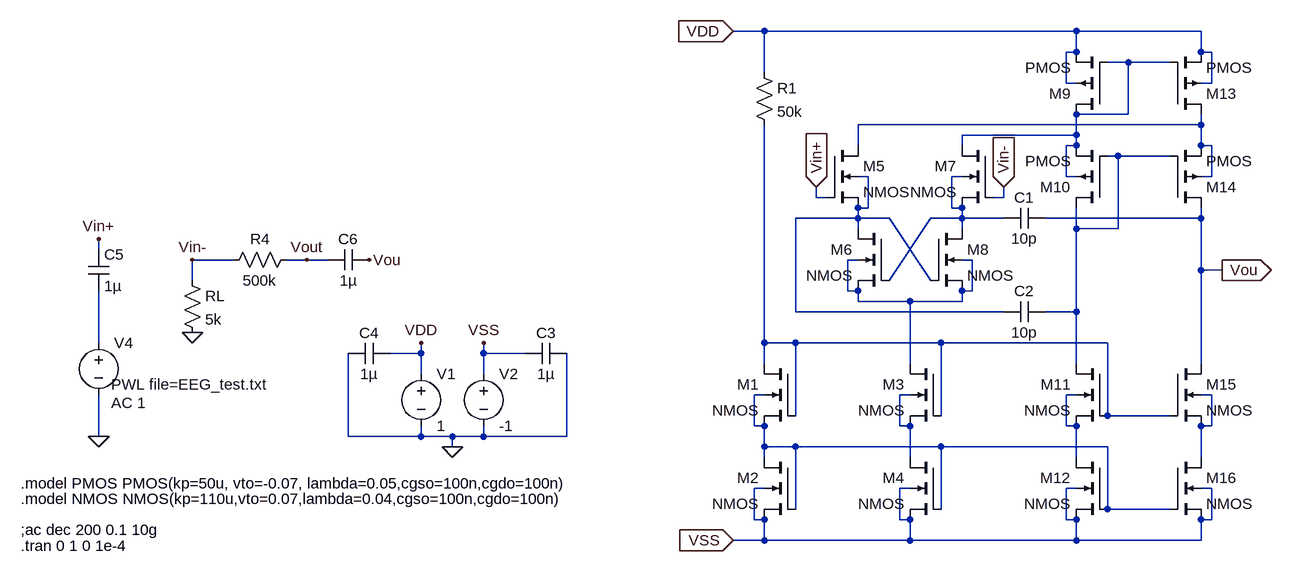
[diagram p0: schematic EEG_Amp1.asc]
EEG_Amp1.asc, the LTspice schematic file:
Version 4
SHEET 1 880 728
WIRE -368 -464 -416 -464
WIRE 112 -464 -368 -464
WIRE 304 -464 112 -464
WIRE 112 -432 112 -464
WIRE 112 -432 96 -432
WIRE 304 -432 304 -464
WIRE 320 -432 304 -432
WIRE 192 -416 160 -416
WIRE 256 -416 192 -416
WIRE -368 -400 -368 -464
WIRE 96 -384 96 -432
WIRE 112 -384 96 -384
WIRE 320 -384 320 -432
WIRE 320 -384 304 -384
WIRE 192 -336 192 -416
WIRE 192 -336 112 -336
WIRE 304 -320 304 -336
WIRE 304 -320 -224 -320
WIRE 112 -304 112 -336
WIRE 112 -304 -64 -304
WIRE -224 -288 -224 -320
WIRE -64 -288 -64 -304
WIRE 112 -288 112 -304
WIRE 112 -288 96 -288
WIRE 304 -288 304 -320
WIRE 320 -288 304 -288
WIRE 176 -272 160 -272
WIRE 256 -272 176 -272
WIRE -208 -240 -224 -240
WIRE -64 -240 -80 -240
WIRE 96 -240 96 -288
WIRE 112 -240 96 -240
WIRE 320 -240 320 -288
WIRE 320 -240 304 -240
WIRE -288 -208 -288 -224
WIRE -272 -208 -288 -208
WIRE 0 -208 0 -224
WIRE 0 -208 -16 -208
WIRE -208 -192 -208 -240
WIRE -208 -192 -224 -192
WIRE -80 -192 -80 -240
WIRE -64 -192 -80 -192
WIRE -224 -176 -224 -192
WIRE -224 -176 -320 -176
WIRE -176 -176 -224 -176
WIRE -64 -176 -64 -192
WIRE -64 -176 -112 -176
WIRE 0 -176 -64 -176
WIRE 304 -176 304 -192
WIRE 304 -176 64 -176
WIRE -224 -160 -224 -176
WIRE -64 -160 -64 -176
WIRE 112 -160 112 -192
WIRE 176 -160 176 -272
WIRE 176 -160 112 -160
WIRE -1392 -128 -1392 -144
WIRE -1184 -112 -1248 -112
WIRE -1072 -112 -1104 -112
WIRE -1040 -112 -1072 -112
WIRE -224 -112 -240 -112
WIRE -48 -112 -64 -112
WIRE 304 -96 304 -176
WIRE 336 -96 304 -96
WIRE -1248 -80 -1248 -112
WIRE -176 -80 -112 -176
WIRE -112 -80 -176 -176
WIRE -240 -64 -240 -112
WIRE -224 -64 -240 -64
WIRE -48 -64 -48 -112
WIRE -48 -64 -64 -64
WIRE -224 -48 -224 -64
WIRE -144 -48 -224 -48
WIRE -64 -48 -64 -64
WIRE -64 -48 -144 -48
WIRE -320 -32 -320 -176
WIRE 0 -32 -320 -32
WIRE 112 -32 112 -160
WIRE 112 -32 64 -32
WIRE -1392 16 -1392 -64
WIRE -368 16 -368 -320
WIRE -320 16 -368 16
WIRE -96 16 -320 16
WIRE 160 16 -96 16
WIRE -896 32 -896 16
WIRE -896 32 -944 32
WIRE -800 32 -800 16
WIRE -736 32 -800 32
WIRE -368 48 -368 16
WIRE -144 48 -144 -48
WIRE 112 48 112 -32
WIRE 304 48 304 -96
WIRE -896 64 -896 32
WIRE -800 64 -800 32
WIRE -368 96 -384 96
WIRE -144 96 -160 96
WIRE 112 96 96 96
WIRE 320 96 304 96
WIRE -320 128 -320 16
WIRE -96 128 -96 16
WIRE 160 128 160 16
WIRE 256 128 160 128
WIRE -384 144 -384 96
WIRE -368 144 -384 144
WIRE -160 144 -160 96
WIRE -144 144 -160 144
WIRE 96 144 96 96
WIRE 112 144 96 144
WIRE 320 144 320 96
WIRE 320 144 304 144
WIRE -1392 160 -1392 96
WIRE -1008 160 -1008 32
WIRE -896 160 -896 144
WIRE -896 160 -1008 160
WIRE -848 160 -896 160
WIRE -800 160 -800 144
WIRE -800 160 -848 160
WIRE -672 160 -672 32
WIRE -672 160 -800 160
WIRE -848 176 -848 160
WIRE -368 176 -368 144
WIRE -320 176 -368 176
WIRE -96 176 -320 176
WIRE 160 176 -96 176
WIRE -368 192 -368 176
WIRE -144 192 -144 144
WIRE 112 192 112 144
WIRE 304 192 304 144
WIRE -368 240 -384 240
WIRE -144 240 -160 240
WIRE 112 240 96 240
WIRE 320 240 304 240
WIRE -320 272 -320 176
WIRE -96 272 -96 176
WIRE 160 272 160 176
WIRE 256 272 160 272
WIRE -384 288 -384 240
WIRE -368 288 -384 288
WIRE -160 288 -160 240
WIRE -144 288 -160 288
WIRE 96 288 96 240
WIRE 112 288 96 288
WIRE 320 288 320 240
WIRE 320 288 304 288
WIRE -368 320 -368 288
WIRE -368 320 -416 320
WIRE -144 320 -144 288
WIRE -144 320 -368 320
WIRE 112 320 112 288
WIRE 112 320 -144 320
WIRE 304 320 304 288
WIRE 304 320 112 320
FLAG 336 -96 Vou
IOPIN 336 -96 Out
FLAG 0 -224 Vin-
IOPIN 0 -224 In
FLAG -288 -224 Vin+
IOPIN -288 -224 In
FLAG -416 -464 VDD
IOPIN -416 -464 In
FLAG -416 320 VSS
IOPIN -416 320 In
FLAG -976 -112 Vou
FLAG -1248 -112 Vin-
FLAG -1392 -144 Vin+
FLAG -896 16 VDD
FLAG -800 16 VSS
FLAG -848 176 0
FLAG -1392 160 0
FLAG -1248 0 0
FLAG -1072 -112 Vout
SYMBOL voltage -896 48 R0
WINDOW 123 0 0 Left 0
WINDOW 39 0 0 Left 0
SYMATTR InstName V1
SYMATTR Value 1
SYMBOL voltage -800 48 R0
WINDOW 123 0 0 Left 0
WINDOW 39 0 0 Left 0
SYMATTR InstName V2
SYMATTR Value -1
SYMBOL res -384 -416 R0
SYMATTR InstName R1
SYMATTR Value 50k
SYMBOL cap 64 -192 R90
WINDOW 0 0 32 VBottom 2
WINDOW 3 32 32 VTop 2
SYMATTR InstName C1
SYMATTR Value 10p
SYMBOL nmos4 -320 48 M0
SYMATTR InstName M1
SYMBOL nmos4 -320 192 M0
SYMATTR InstName M2
SYMBOL nmos4 -96 48 M0
SYMATTR InstName M3
SYMBOL nmos4 -96 192 M0
SYMATTR InstName M4
SYMBOL nmos4 -272 -288 R0
SYMATTR InstName M5
SYMBOL nmos4 -176 -160 M0
SYMATTR InstName M6
SYMBOL nmos4 -16 -288 M0
SYMATTR InstName M7
SYMBOL nmos4 -112 -160 R0
SYMATTR InstName M8
SYMBOL pmos4 160 -336 R180
SYMATTR InstName M9
SYMBOL pmos4 160 -192 R180
SYMATTR InstName M10
SYMBOL nmos4 160 48 M0
SYMATTR InstName M11
SYMBOL nmos4 160 192 M0
SYMATTR InstName M12
SYMBOL pmos4 256 -336 M180
SYMATTR InstName M13
SYMBOL pmos4 256 -192 M180
SYMATTR InstName M14
SYMBOL nmos4 256 48 R0
SYMATTR InstName M15
SYMBOL nmos4 256 192 R0
SYMATTR InstName M16
SYMBOL cap -672 16 R90
WINDOW 0 0 32 VBottom 2
WINDOW 3 32 32 VTop 2
SYMATTR InstName C3
SYMATTR Value 1µ
SYMBOL cap -944 16 R90
WINDOW 0 0 32 VBottom 2
WINDOW 3 32 32 VTop 2
SYMATTR InstName C4
SYMATTR Value 1µ
SYMBOL voltage -1392 0 R0
WINDOW 123 19 108 Left 2
WINDOW 39 0 0 Left 0
WINDOW 3 19 80 Left 2
SYMATTR Value2 AC 1
SYMATTR Value PWL file=EEG_test.txt
SYMATTR InstName V4
SYMBOL cap -1408 -128 R0
SYMATTR InstName C5
SYMATTR Value 1µ
SYMBOL cap -1040 -96 R270
WINDOW 0 32 32 VTop 2
WINDOW 3 0 32 VBottom 2
SYMATTR InstName C6
SYMATTR Value 1µ
SYMBOL cap 64 -48 R90
WINDOW 0 0 32 VBottom 2
WINDOW 3 32 32 VTop 2
SYMATTR InstName C2
SYMATTR Value 10p
SYMBOL res -1264 -96 R0
SYMATTR InstName RL
SYMATTR Value 5k
SYMBOL res -1088 -128 R90
WINDOW 0 0 56 VBottom 2
WINDOW 3 32 56 VTop 2
SYMATTR InstName R4
SYMATTR Value 500k
TEXT -1512 232 Left 2 !.model PMOS PMOS(kp=50u, vto=-0.07, lambda=0.05,cgso=100n,cgdo=100n)
TEXT -1512 256 Left 2 !.model NMOS NMOS(kp=110u,vto=0.07,lambda=0.04,cgso=100n,cgdo=100n)
TEXT -1512 304 Left 2 !;ac dec 200 0.1 10g
TEXT -1512 328 Left 2 !.tran 0 1 0 1e-4

The netlist it stands for:
* EEG_Amp1.asc
V1 VDD 0 1
V2 VSS 0 -1
R1 VDD N008 50k
C1 Vou N005 10p
M1 N008 N008 N009 N009 NMOS
M2 N009 N009 VSS VSS NMOS
M3 N006 N008 N010 N010 NMOS
M4 N010 N009 VSS VSS NMOS
M5 N002 Vin+ N004 N004 NMOS
M6 N004 N005 N006 N006 NMOS
M7 N001 Vin- N005 N005 NMOS
M8 N005 N004 N006 N006 NMOS
M9 N001 N001 VDD VDD PMOS
M10 N003 N003 N001 N001 PMOS
M11 N003 N008 N011 N011 NMOS
M12 N011 N009 VSS VSS NMOS
M13 N002 N001 VDD VDD PMOS
M14 Vou N003 N002 N002 PMOS
M15 Vou N008 N012 N012 NMOS
M16 N012 N009 VSS VSS NMOS
C3 0 VSS 1µ
C4 VDD 0 1µ
V4 N007 0 PWL file=EEG_test.txt AC 1
C5 Vin+ N007 1µ
C6 Vout Vou 1µ
C2 N003 N004 10p
RL Vin- 0 5k
R4 Vout Vin- 500k
.model NMOS NMOS
.model PMOS PMOS
.lib standard.mos
.model PMOS PMOS(kp=50u, vto=-0.07, lambda=0.05,cgso=100n,cgdo=100n)
.model NMOS NMOS(kp=110u,vto=0.07,lambda=0.04,cgso=100n,cgdo=100n)
;ac dec 200 0.1 10g
.tran 0 1 0 1e-4
.backanno
.end